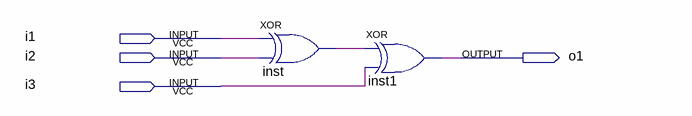
[diagram p0: schematic sheet]
// Quartus schematic xor_3.bdf as structural Verilog: 2 symbols, 4 pins
module xor_3 (
  input  i1,
  input  i2,
  input  i3,
  output o1
);

  wire inst_out;

  xor inst (inst_out, i1, i2);
  xor inst1 (o1, inst_out, i3);
endmodule
